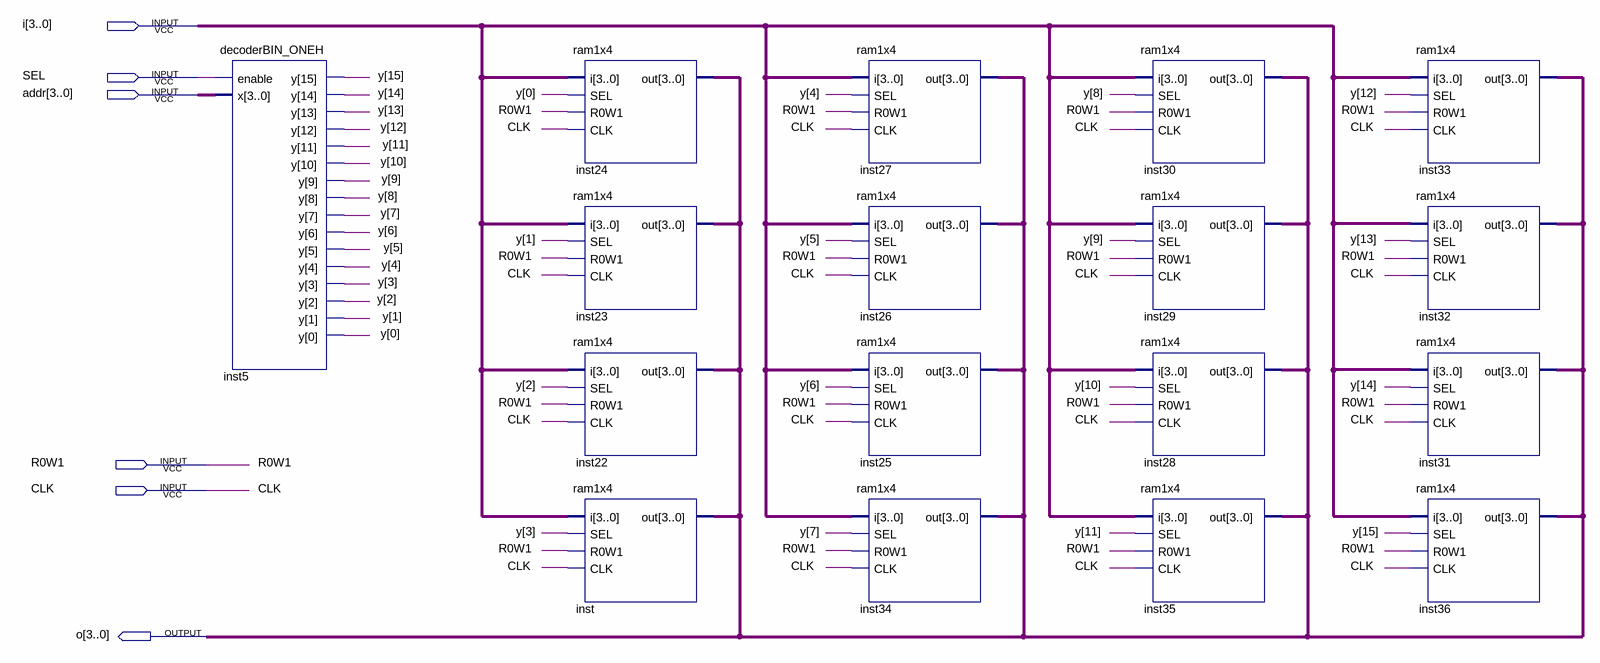
[diagram p0: schematic sheet]
// Quartus schematic ram.bdf as structural Verilog: 17 symbols, 6 pins
module ram (
  input  [3:0] i,
  input  SEL,
  input  [3:0] addr,
  input  R0W1,
  input  CLK,
  output [3:0] o
);

  wire [15:0] y;

  decoderBIN_ONEH inst5 (.enable(SEL), .x(addr), .y(y));
  ram1x4 inst24 (.i(i), .SEL(y[0]), .R0W1(R0W1), .CLK(CLK), .out(o));
  ram1x4 inst23 (.i(i), .SEL(y[1]), .R0W1(R0W1), .CLK(CLK), .out(o));
  ram1x4 inst22 (.i(i), .SEL(y[2]), .R0W1(R0W1), .CLK(CLK), .out(o));
  ram1x4 inst (.i(i), .SEL(y[3]), .R0W1(R0W1), .CLK(CLK), .out(o));
  ram1x4 inst27 (.i(i), .SEL(y[4]), .R0W1(R0W1), .CLK(CLK), .out(o));
  ram1x4 inst26 (.i(i), .SEL(y[5]), .R0W1(R0W1), .CLK(CLK), .out(o));
  ram1x4 inst25 (.i(i), .SEL(y[6]), .R0W1(R0W1), .CLK(CLK), .out(o));
  ram1x4 inst34 (.i(i), .SEL(y[7]), .R0W1(R0W1), .CLK(CLK), .out(o));
  ram1x4 inst30 (.i(i), .SEL(y[8]), .R0W1(R0W1), .CLK(CLK), .out(o));
  ram1x4 inst29 (.i(i), .SEL(y[9]), .R0W1(R0W1), .CLK(CLK), .out(o));
  ram1x4 inst28 (.i(i), .SEL(y[10]), .R0W1(R0W1), .CLK(CLK), .out(o));
  ram1x4 inst35 (.i(i), .SEL(y[11]), .R0W1(R0W1), .CLK(CLK), .out(o));
  ram1x4 inst33 (.i(i), .SEL(y[12]), .R0W1(R0W1), .CLK(CLK), .out(o));
  ram1x4 inst32 (.i(i), .SEL(y[13]), .R0W1(R0W1), .CLK(CLK), .out(o));
  ram1x4 inst31 (.i(i), .SEL(y[14]), .R0W1(R0W1), .CLK(CLK), .out(o));
  ram1x4 inst36 (.i(i), .SEL(y[15]), .R0W1(R0W1), .CLK(CLK), .out(o));
endmodule
